# EAGLE design ESPRELAYS (EAGLE 9.4.2)
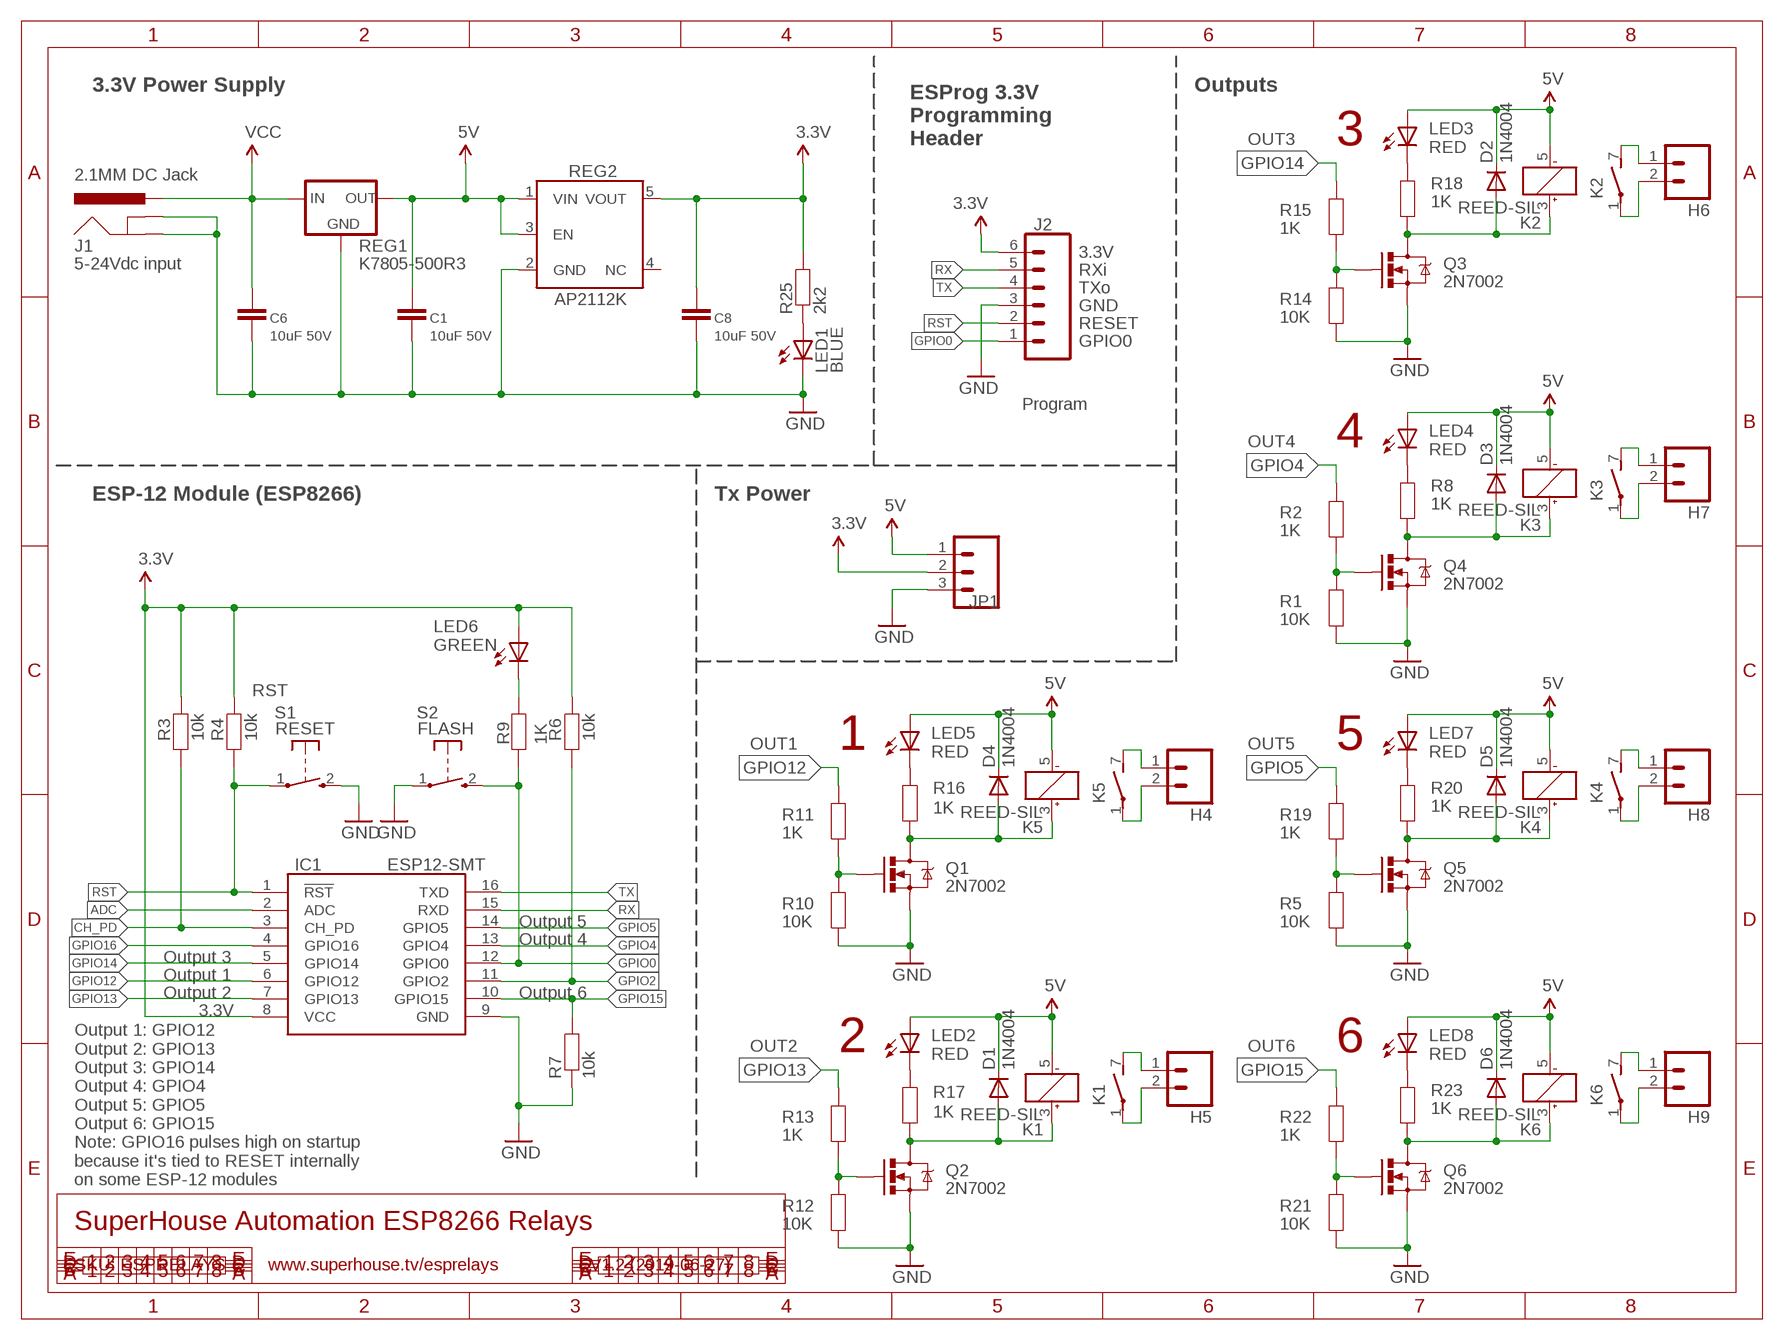
[diagram p0: schematic, sheet 1]

## Parts
C1  10uF 50V  CAP0805  [C0805]
C6  10uF 50V  CAP0805  [C0805]
C8  10uF 50V  CAP0805  [C0805]
D1  1N4004  DIODESMA  [SMA-DIODE]
D2  1N4004  DIODESMA  [SMA-DIODE]
D3  1N4004  DIODESMA  [SMA-DIODE]
D4  1N4004  DIODESMA  [SMA-DIODE]
D5  1N4004  DIODESMA  [SMA-DIODE]
D6  1N4004  DIODESMA  [SMA-DIODE]
H4  M02-PIN  [1X02-P]
H5  M02-PIN  [1X02-P]
H6  M02-PIN  [1X02-P]
H7  M02-PIN  [1X02-P]
H8  M02-PIN  [1X02-P]
H9  M02-PIN  [1X02-P]
IC1  ESP12-SMT  [ESP12]
J1  2.1MM DC Jack  POWER_JACK-SLOTS  [POWER_JACK_SLOTS]
J2  Program  M06-SOCKET  [1X06-S]
JP1  M03-PLAIN  [1X03]
K1  REED-SIL  [REED]
K2  REED-SIL  [REED]
K3  REED-SIL  [REED]
K4  REED-SIL  [REED]
K5  REED-SIL  [REED]
K6  REED-SIL  [REED]
LED1  BLUE  LED0603  [LED-0603]
LED2  RED  LED0603  [LED-0603]
LED3  RED  LED0603  [LED-0603]
LED4  RED  LED0603  [LED-0603]
LED5  RED  LED0603  [LED-0603]
LED6  GREEN  LED0603  [LED-0603]
LED7  RED  LED0603  [LED-0603]
LED8  RED  LED0603  [LED-0603]
Q1  2N7002  MOSFET-NCHANNELSMD  [SOT23-3]
Q2  2N7002  MOSFET-NCHANNELSMD  [SOT23-3]
Q3  2N7002  MOSFET-NCHANNELSMD  [SOT23-3]
Q4  2N7002  MOSFET-NCHANNELSMD  [SOT23-3]
Q5  2N7002  MOSFET-NCHANNELSMD  [SOT23-3]
Q6  2N7002  MOSFET-NCHANNELSMD  [SOT23-3]
R1  10K  RESISTOR0603  [R0603]
R2  1K  RESISTOR0603  [R0603]
R3  10k  RESISTOR0603  [R0603]
R4  10k  RESISTOR0603  [R0603]
R5  10K  RESISTOR0603  [R0603]
R6  10k  RESISTOR0603  [R0603]
R7  10k  RESISTOR0603  [R0603]
R8  1K  RESISTOR0603  [R0603]
R9  1K  RESISTOR0603  [R0603]
R10  10K  RESISTOR0603  [R0603]
R11  1K  RESISTOR0603  [R0603]
R12  10K  RESISTOR0603  [R0603]
R13  1K  RESISTOR0603  [R0603]
R14  10K  RESISTOR0603  [R0603]
R15  1K  RESISTOR0603  [R0603]
R16  1K  RESISTOR0603  [R0603]
R17  1K  RESISTOR0603  [R0603]
R18  1K  RESISTOR0603  [R0603]
R19  1K  RESISTOR0603  [R0603]
R20  1K  RESISTOR0603  [R0603]
R21  10K  RESISTOR0603  [R0603]
R22  1K  RESISTOR0603  [R0603]
R23  1K  RESISTOR0603  [R0603]
R25  2k2  RESISTOR0603  [R0603]
REG1  K7805-500R3  K78XX-500R3  [K78XX-500R3]
REG2  AP2112KSOT25  [SOT23-5]
S1  RESET  TAC_SWITCH_2PINSMT  [TACTILE_SMD_3X4X2]
S2  FLASH  TAC_SWITCH_2PINSMT  [TACTILE_SMD_3X4X2]

## Nets
3.3V: C8.1 IC1.8(VCC) J2.6 JP1.2 LED6.A R3.2 R4.2 R6.2 R25.2 REG2.5(VOUT)
5V: C1.1 D1.C D2.C D3.C D4.C D5.C D6.C JP1.1 K1.5(1:-) K2.5(1:-) K3.5(1:-) K4.5(1:-) K5.5(1:-) K6.5(1:-) LED2.A LED3.A LED4.A LED5.A LED7.A LED8.A REG1.3(OUT) REG2.1(VIN) REG2.3(EN)
ADC: IC1.2(ADC)
CH_PD: IC1.3(CH_PD) R3.1
GND: C1.2 C6.2 C8.2 IC1.9(GND) J1.GND J1.GNDBREAK J2.3 JP1.3 LED1.C Q1.2(S) Q2.2(S) Q3.2(S) Q4.2(S) Q5.2(S) Q6.2(S) R1.1 R5.1 R7.1 R10.1 R12.1 R14.1 R21.1 REG1.2(GND) REG2.2(GND) S1.2(S) S2.1(P)
GPIO0: IC1.12(GPIO0) J2.1 R9.2 S2.2(S)
GPIO2: IC1.11(GPIO2) R6.1
GPIO4: IC1.13(GPIO4) R2.2
GPIO5: IC1.14(GPIO5) R19.2
GPIO12: IC1.6(GPIO12) R11.2
GPIO13: IC1.7(GPIO13) R13.2
GPIO14: IC1.5(GPIO14) R15.2
GPIO15: IC1.10(GPIO15) R7.2 R22.2
GPIO16: IC1.4(GPIO16)
N$1: Q1.1(G) R10.2 R11.1
N$2: Q2.1(G) R12.2 R13.1
N$3: H5.1 K1.7(2:S)
N$4: LED3.C R18.1
N$5: H5.2 K1.1(2:P)
N$6: H6.1 K2.7(2:S)
N$7: Q4.1(G) R1.2 R2.1
N$8: H4.1 K5.7(2:S)
N$9: H6.2 K2.1(2:P)
N$10: Q3.1(G) R14.2 R15.1
N$11: LED4.C R8.1
N$12: H4.2 K5.1(2:P)
N$13: H7.1 K3.7(2:S)
N$14: H7.2 K3.1(2:P)
N$15: H8.1 K4.7(2:S)
N$16: H8.2 K4.1(2:P)
N$17: H9.1 K6.7(2:S)
N$18: H9.2 K6.1(2:P)
N$19: Q5.1(G) R5.2 R19.1
N$20: LED7.C R20.1
N$21: LED2.C R17.1
N$22: Q6.1(G) R21.2 R22.1
N$23: LED1.A R25.1
N$24: LED5.C R16.1
N$26: LED8.C R23.1
N$27: LED6.C R9.1
OUT1: D4.A K5.3(1:+) Q1.3(D) R16.2
OUT2: D1.A K1.3(1:+) Q2.3(D) R17.2
OUT3: D2.A K2.3(1:+) Q3.3(D) R18.2
OUT4: D3.A K3.3(1:+) Q4.3(D) R8.2
OUT5: D5.A K4.3(1:+) Q5.3(D) R20.2
OUT6: D6.A K6.3(1:+) Q6.3(D) R23.2
RST: IC1.1(!RST) J2.2 R4.1 S1.1(P)
RX: IC1.15(RXD) J2.5
TX: IC1.16(TXD) J2.4
VCC: C6.1 J1.PWR REG1.1(IN)
Unconnected: REG2.4(NC)

## Notes on the sheet
- 3.3V Power Supply | Outputs
- ESProg 3.3V
  Programming
  Header
- 3
- 3.3V
- 5-24Vdc input | RXi
- TXo
- GND
- RESET
- GPIO0
- 4
- ESP-12 Module (ESP8266) | Tx Power
- 1 | 5
- Output 5
- Output 4
- Output 3
- Output 1
- Output 2 | Output 6
- 2 | 6
- Output 1: GPIO12
  Output 2: GPIO13
  Output 3: GPIO14
  Output 4: GPIO4
  Output 5: GPIO5
  Output 6: GPIO15
  Note: GPIO16 pulses high on startup
  because it's tied to RESET internally
  on some ESP-12 modules
- SuperHouse Automation ESP8266 Relays
- SKU: ESPRELAYS | www.superhouse.tv/esprelays | V1.2 (2019-06-27)

## Library data of the parts
C1 C6 C8 = SuperHouse-DiscreteSemi:CAP: Capacitor Standard ceramic capacitor
D1-D6 = SuperHouse-DiscreteSemi:DIODE: Diode Standard reverse protection diodes and small signal diodes. SMA package can handle up to about 1A. SOD-323 can handle about 200mA.
H4-H9 = SuperHouse-Connectors:M02: Header 1x5 Standard 0.1" header.
IC1 = SuperHouse-MCUs:ESP12: ESP-12 module
J1 = SuperHouse-Connectors:POWER_JACK: Power Jack This is the standard 5.5mm barrel jack for power. The PTH is the most common, proven, reliable, footprint. All others are experimental. The Slot footprint only works if the mill layer is transmitted to the PCB fab house so be warned. Spark Fun Electronics SKU : PRT-00119. Mating wall wart : TOL-00298 (and others)
J2 = SuperHouse-Connectors:M06
JP1 = SuperHouse-Connectors:M03: Header 1x5 Standard 0.1" header.
K1-K6 = SuperHouse-Relays:REED: RELAY reed, 1 x norm. open with polarity, grid 5.08
LED1-LED8 = SuperHouse-LEDs:LED: LEDs Standard schematic elements and footprints for 5mm, 3mm, 1206, and 0603 sized LEDs. 5mm - Spark Fun Electronics SKU : COM-00529 (and others)
Q1-Q6 = SuperHouse-DiscreteSemi:MOSFET-NCHANNEL
R1-R23 R25 = SuperHouse-DiscreteSemi:RESISTOR: Resistor Standard resistors.
REG1 = SuperHouse-Regulators:K78XX-500R3: K78xx-500R3 switchmode voltage regulator
REG2 = SuperHouse-Regulators:AP2112K: AP2112K LDO linear voltage regulator
S1 S2 = SuperHouse-Switches:TAC_SWITCH_2PIN: Momentary Tactile Switch - 2 pin Uxcell 3x4x2mm switch with 2 SMT pads

## Net classes
0 default: width 0.203 mm, drill 0.356 mm, clearance 0.152 mm
1 power: width 0.203 mm, clearance 0.152 mm

## Board
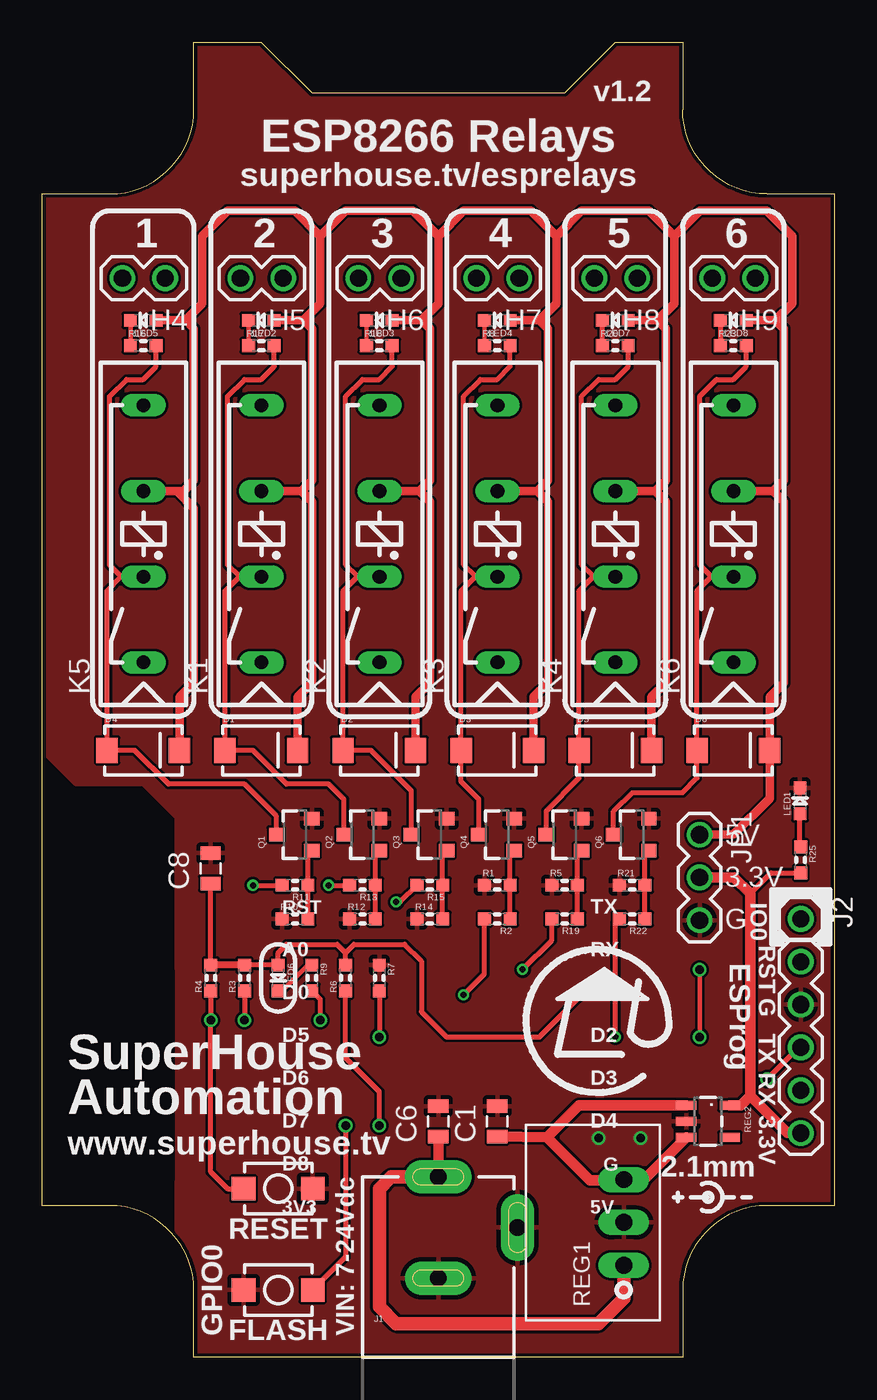
[diagram p1: board, top side]
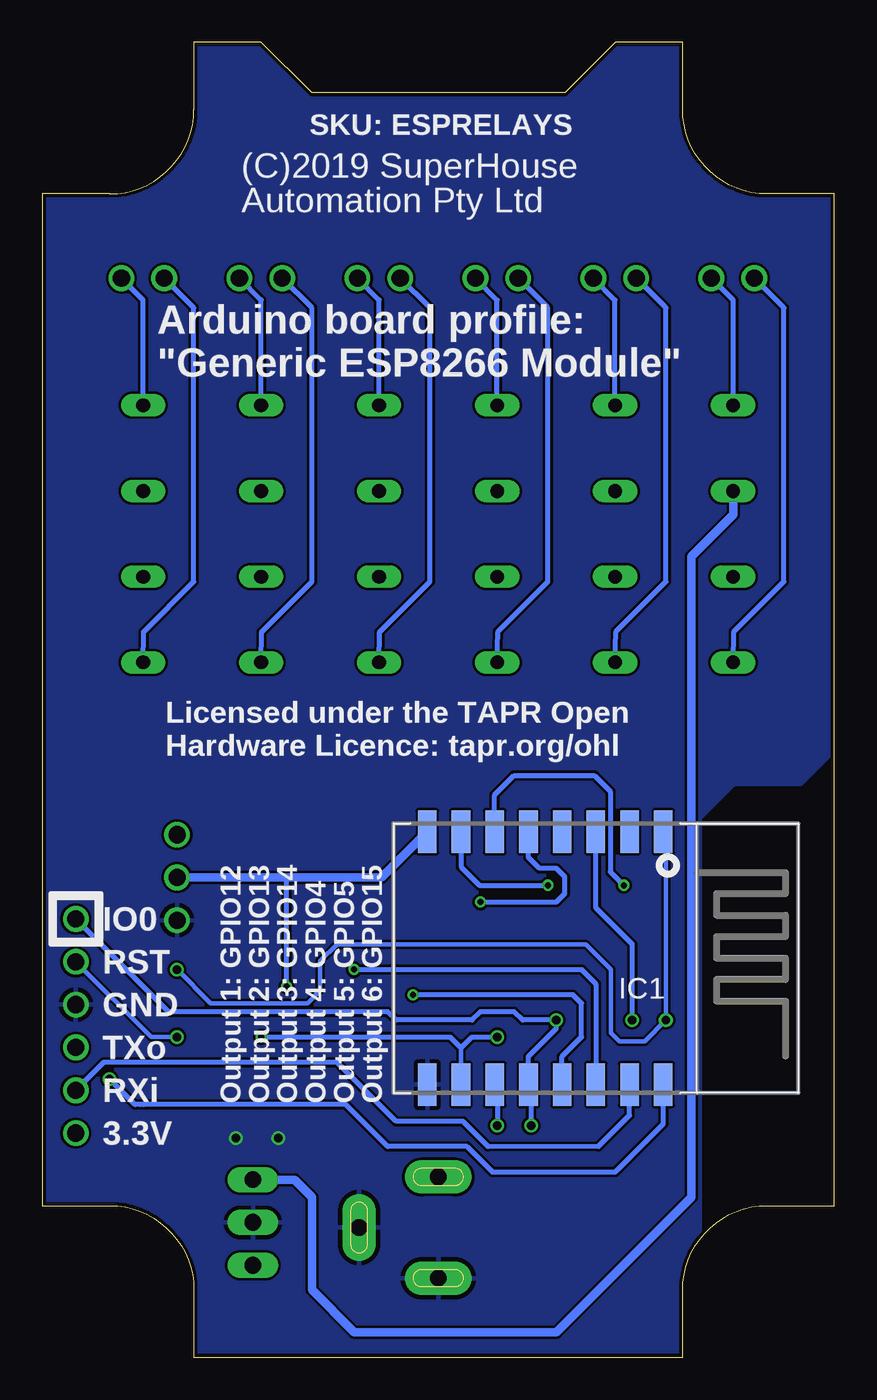
[diagram p2: board, bottom side, seen from below]

Size 47 x 78 mm. Coordinates in mm from the lower left corner, seen from the top.
Outline: 4,9 0,9 0,69 4,69 arc90 9,74 9,78 13,78 16,75 31,75 34,78 38,78 38,74 arc90 43,69 47,69 47,9 43,9 arc90 38,4 38,0 9,0 9,4 arc90 4,9
Copper layers (1*16): Top 0.035mm / dielectric 1.5mm / Bottom 0.035mm
Design rules "ElectroDragon_2layer_DRU_no_angle_20140221": minimum track width 6mil, minimum drill 12mil, track to track 6mil, track to pad 6mil, pad to pad 6mil, via to via 6mil, smd to smd 6mil, copper to edge 8mil, drill to drill 6mil, minimum pad ring 10mil, minimum via ring 6mil, stop-mask expansion 4mil, vias tented up to drill 100mil, thermal gap 10mil

### Footprints (pad centres in the part's own frame; a part is rotated, then mirrored left to right if it is on the bottom)
C0805 = smd 0.8 x 1.2: 1 -0.9,0; 2 0.9,0
SMA-DIODE = smd 1.27 x 1.47: A -2.15,0; C 2.15,0
1X02-P = drill 1.016: 1 0,0; 2 2.54,0
ESP12 = smd 1.1 x 2.5: 1 -4,-7.5; 2 -2,-7.5; 3 0,-7.5; 4 2,-7.5; 5 4,-7.5; 6 6,-7.5; 7 8,-7.5; 8 10,-7.5; 9 10,7.5; 10 8,7.5; 11 6,7.5; 12 4,7.5; 13 2,7.5; 14 0,7.5; 15 -2,7.5; 16 -4,7.5
POWER_JACK_SLOTS = drill 1 pad 2 long: GND 0,7.7; GNDBREAK 4.7,10.7; PWR 0,13.7
1X06-S = drill 1.016: 1 0,0; 2 2.54,0; 3 5.08,0; 4 7.62,0; 5 10.16,0; 6 12.7,0
1X03 = drill 1.016: 1 0,0; 2 2.54,0; 3 5.08,0
REED = drill 0.813 long: 1 -17.78,2.54; 3 -12.7,2.54; 5 -7.62,2.54; 7 -2.54,2.54
LED-0603 = smd 0.762 x 0.762: A -0.762,0; C 0.762,0
SOT23-3 = smd 0.8 x 0.9: 1 -0.95,-1; 2 0.95,-1; 3 0,1.1
R0603 = smd 0.762 x 0.762: 1 -0.762,0; 2 0.762,0
K78XX-500R3 = drill 1 long: 1 -2.54,0; 2 0,0; 3 2.54,0
SOT23-5 = smd 0.55 x 1.2: 1 -0.95,-1.3; 2 0,-1.3; 3 0.95,-1.3; 4 0.95,1.3; 5 -0.95,1.3
TACTILE_SMD_3X4X2 = smd 1.4 x 1.4: 1 -2.05,0; 2 2.05,0

### Placement (x,y rotation side)
C1  27,14 90 top
C6  23.5,14 90 top
C8  10,29 90 top
D1  13,36 0 top
D2  20,36 0 top
D3  27,36 0 top
D4  6,36 0 top
D5  34,36 0 top
D6  41,36 0 top
H4  7.3,64 180 top
H5  14.3,64 180 top
H6  21.3,64 180 top
H7  28.3,64 180 top
H8  35.3,64 180 top
H9  42.3,64 180 top
IC1  14.15,23.68 180 bottom
J1  23.5,-3 0 top
J2  45,26 270 top
JP1  39,31 270 top
K1  15.55,59 90 top
K2  22.55,59 90 top
K3  29.55,59 90 top
K4  36.55,59 90 top
K5  8.55,59 90 top
K6  43.55,59 90 top
LED1  44.96,33 90 top
LED2  13,61.5 180 top
LED3  20,61.5 180 top
LED4  27,61.5 180 top
LED5  6,61.5 180 top
LED6  14,22.5 270 top
LED7  34,61.5 180 top
LED8  41,61.5 180 top
Q1  15,31 90 top
Q2  19,31 90 top
Q3  23,31 90 top
Q4  27,31 90 top
Q5  31,31 90 top
Q6  35,31 90 top
R1  27,28 0 top
R2  27,26 180 top
R3  12,22.5 90 top
R4  10,22.5 90 top
R5  31,28 0 top
R6  18,22.5 90 top
R7  20,22.5 270 top
R8  27,60 0 top
R9  16,22.5 270 top
R10  15,26 0 top
R11  15,28 180 top
R12  19,26 0 top
R13  19,28 180 top
R14  23,26 0 top
R15  23,28 180 top
R16  6,60 0 top
R17  13,60 0 top
R18  20,60 0 top
R19  31,26 180 top
R20  34,60 0 top
R21  35,28 0 top
R22  35,26 180 top
R23  41,60 0 top
R25  45,29.5 270 top
REG1  34.5,8 90 top
REG2  39.5,14 270 top
S1  14,10 0 top
S2  14,4 0 top

### Tracks (layer width: path | path; a pad name or v marks a point on that pad's centre or on a via)
3.3V  (via drill 0.36)
  Top 0.305: R3.2 LED6.A 14,24 14.5,24.5 17.5,24.5 18,24 | R6.2 18,24 | R4.2 C8.1 | 18,24 18.5,24.5 21.5,24.5 22.5,23.5 22.5,20.5 24,19 29.5,19 v32.5,22 | 42,27.5 43.24,28.74 R25.2
  Top 0.406: R3.2 R4.2
  Top 0.61: 42,15.5 41.45,14.95 REG2.5 | JP1.2 41.04,28.46 42,27.5 42,15.5 | J2.6 44.2,13.3 42,15.5
  Bottom 0.305: v32.5,22 32.5,28.46
  Bottom 0.508: IC1.8 26.87,28.46 32.5,28.46 JP1.2
5V
  Top 0.508: 8.5,61.5 9,61 9,52 8.38,51.38 8,51.38 | 8.5,61.5 LED5.A | 8.5,61.5 9.5,62.5 9.5,66.5 11,68 15,68 16.5,66.5 | 16.5,66.5 16.5,62.5 15.5,61.5 | 15.5,61.5 LED2.A | 15.5,61.5 16,61 16,52 15.38,51.38 | 22.5,61.5 23,61 23,52 22.38,51.38 | 22.5,61.5 LED3.A | 16.5,66.5 18,68 22,68 23.5,66.5 | 23.5,66.5 23.5,62.5 22.5,61.5 | 29.5,61.5 30,61 30,52 29.38,51.38 | 29.5,61.5 LED4.A | 23.5,66.5 25,68 29,68 30.5,66.5 | 30.5,66.5 30.5,62.5 29.5,61.5 | 36.5,61.5 37,61 37,52 36.38,51.38 | 36.5,61.5 LED7.A | 30.5,66.5 32,68 36,68 37.5,66.5 | 36.5,61.5 37.5,62.5 37.5,66.5 | 37.5,66.5 39,68 43,68 44.5,66.5 44.5,62.5 43.5,61.5 | 8,51.38 K5.5 | 15.38,51.38 K1.5 | 22.38,51.38 K2.5 | 29.38,51.38 K3.5 | 36.38,51.38 K4.5 | 43.38,51.38 44,52 44,61 43.5,61.5 | 43.38,51.38 K6.5 | 43.5,61.5 LED8.A | 15.38,51.38 16,50.76 16,40 15.15,39.15 D1.C | 8,51.38 9,50.38 9,40 8.15,39.15 D4.C | 22.38,51.38 23,50.76 23,40 22.15,39.15 D2.C | 29.38,51.38 30,50.76 30,40 29.15,39.15 D3.C | 36.38,51.38 37,50.76 37,40 36.15,39.15 D5.C | 43.38,51.38 44,50.76 44,40 43.15,39.15 D6.C 43.15,33.15 41,31 JP1.1
  Top 0.61: REG2.3 35.69,10.54 REG1.3 34.46,10.5 32.5,10.5 29.95,13.05 | 29.95,13.05 C1.1 | REG2.1 31.85,14.95 29.95,13.05
  Bottom 0.508: REG1.3 32.04,10.54 31,9.5 31,4 28.5,1.5 16.5,1.5 8.5,9.5 8.5,47.5 6.01,49.99 K5.5
CH_PD  (via drill 0.5)
  Top 0.305: R3.1 v12,20
  Bottom 0.305: v12,20 12,24.5 14.15,26.65 IC1.3
GND  (via drill 0.5)
  other vias: 35.5,13 33,13
  pour Top: 7.98,7 arc-40 8.98,4 8.98,0 38,0 38,4 arc-90 43,9 47,9 47,78 0,78 0,36 2,34 6,34 7.99,32.01 7.99,32 7.98,32 8,14
  pour Bottom: 47,78 0,78 0,36 2,34 5.98,34 7.98,32 8,14 7.98,7 arc-40 8.98,4 8.98,0 38,0 38,4 arc-90 43,9 47,9
GPIO0  (via drill 0.5)
  Top 0.305: R9.2 16.5,21.24 v16.5,20 | S2.2 18,5.95 v18,13.75
  Bottom 0.254: IC1.12 18,16.02
  Bottom 0.305: 18,16.02 v18,13.75 | IC1.12 18.15,17.85 16.5,19.5 v16.5,20 18.5,20 19,20.5 21,20.5 21.5,20 26,20 26.5,20.5 39.5,20.5 J2.1
GPIO2  (via drill 0.5)
  Top 0.305: R6.1 18,17.75 20,15.75 v20,13.75
  Bottom 0.254: IC1.11 20,16.02
  Bottom 0.305: 20,16.02 v20,13.75
GPIO4  (via drill 0.36)
  Top 0.305: v25,21.5 26.24,22.74 R2.2
  Bottom 0.305: IC1.13 16.15,17.85 15,19 15,21 15.5,21.5 v25,21.5
GPIO5  (via drill 0.36)
  Top 0.305: v28.5,23 30.24,24.74 R19.2
  Bottom 0.305: IC1.14 14.15,22.15 15,23 v28.5,23
GPIO12  (via drill 0.36)
  Top 0.305: v12.5,28 R11.2
  Bottom 0.305: IC1.6 20.15,33.35 19,34.5 14.24,34.5 13.3,33.55 13.3,28.8 v12.5,28
GPIO13  (via drill 0.36)
  Top 0.305: v17,28 R13.2
  Bottom 0.305: IC1.7 22.15,29.1 21.06,28 v17,28
GPIO14  (via drill 0.36)
  Top 0.305: R15.2 21.24,27 v21,27
  Bottom 0.305: v21,27 16.5,27 16,27.5 16,28.5 16.5,29 17.5,29 18.15,29.65 IC1.5
GPIO15  (via drill 0.36, 0.5)
  Top 0.305: R7.2 v20,19 | v34,19 34,25.76 R22.2
  Bottom 0.254: 22.15,18.35 IC1.10
  Bottom 0.305: v20,19 21.5,19 22.15,18.35 22.81,19 v34,19
N$1
  Top 0.254: 15.76,29.81 Q1.1
  Top 0.305: R10.2 R11.1 15.76,29.81
N$2
  Top 0.254: 19.76,29.81 Q2.1
  Top 0.305: R12.2 R13.1 19.76,29.81
N$3
  Bottom 0.305: K1.7 13.01,62.71 H5.1
N$4
  Top 0.254: R18.1 LED3.C
N$5
  Bottom 0.305: K1.1 12.96,43.04 10,46 10,62.24 H5.2
N$6
  Bottom 0.305: K2.7 20.01,62.71 H6.1
N$7
  Top 0.305: R2.1 R1.2 27.76,29.81 Q4.1
N$8
  Bottom 0.305: K5.7 6.01,62.71 H4.1
N$9
  Bottom 0.305: K2.1 19.96,43.04 17,46 17,62.24 H6.2
N$10
  Top 0.254: 23.76,29.81 Q3.1
  Top 0.305: R14.2 R15.1 23.76,29.81
N$11
  Top 0.254: R8.1 LED4.C
N$12
  Bottom 0.305: K5.1 5.96,43.04 3,46 3,62.24 H4.2
N$13
  Bottom 0.305: K3.7 27.01,62.71 H7.1
N$14
  Bottom 0.305: K3.1 26.98,43.02 24,46 24,62.24 H7.2
N$15
  Bottom 0.305: K4.7 34.01,62.71 H8.1
N$16
  Bottom 0.305: K4.1 33.98,43.02 31,46 31,62.24 H8.2
N$17
  Bottom 0.305: K6.7 41.01,62.71 H9.1
N$18
  Bottom 0.305: K6.1 40.98,43.02 38,46 38,62.24 H9.2
N$19
  Top 0.305: R19.1 R5.2 31.76,29.81 Q5.1
N$20
  Top 0.305: R20.1 LED7.C
N$21
  Top 0.254: R17.1 LED2.C
N$22
  Top 0.305: R22.1 R21.2 35.76,29.81 Q6.1
N$23
  Top 0.305: R25.1 44.96,30.3 LED1.A
N$24
  Top 0.254: R16.1 LED5.C
N$26
  Top 0.305: LED8.C R23.1
N$27
  Top 0.254: LED6.C 14.24,21.74 15.76,23.26 R9.1
OUT1
  Top 0.305: K5.3 4.7,46.3 | 4.7,46.3 4,47 4,57 5,58 6,58 6.76,58.76 R16.2 | 4.7,46.3 3.85,45.45 D4.A 5.5,36 7.5,34 12,34 13.9,32.1 Q1.3
OUT2
  Top 0.305: K1.3 11.7,46.3 | 11.7,46.3 11,47 11,57 12,58 13,58 13.76,58.76 R17.2 | 11.7,46.3 10.85,45.45 D1.A 12.5,36 14.5,34 17,34 17.9,33.1 Q2.3
OUT3
  Top 0.305: K2.3 18.7,46.3 | 18.7,46.3 18,47 18,57 19,58 20,58 20.76,58.76 R18.2 | 18.7,46.3 17.85,45.45 D2.A 19.5,36 21.9,33.6 Q3.3
OUT4
  Top 0.305: K3.3 25.7,46.3 | 25.7,46.3 25,47 25,57 26,58 27,58 27.76,58.76 R8.2 | 25.7,46.3 24.85,45.45 D3.A 24.85,34.15 25.9,33.1 Q4.3
OUT5
  Top 0.305: K4.3 32.7,46.3 | 32.7,46.3 32,47 32,57 33,58 34,58 34.76,58.76 R20.2 | 32.7,46.3 31.85,45.45 D5.A 31.85,34.35 29.9,32.4 Q5.3
OUT6
  Top 0.305: K6.3 39.7,46.3 | 39.7,46.3 39,47 39,57 40,58 41,58 41.76,58.76 R23.2 | 39.7,46.3 38.85,45.45 D6.A 38.85,34.35 38,33.5 35,33.5 33.9,32.4 Q6.3
RST  (via drill 0.5)
  Top 0.254: v39,23 v39,19
  Top 0.305: R4.1 v10,20 10,11 11,10 S1.1
  Bottom 0.254: v39,23 37,21 31.25,21 30.5,21.75 30.5,23.5 29.5,24.5 14.75,24.5 13.25,23 13.25,19.25 12.75,18.75 11.25,18.75 v10,20 10,31.02 IC1.1 | v39,19 40.54,19 J2.2
RX
  Bottom 0.254: 20.55,12.5 14,12.5
  Bottom 0.305: 20.55,12.5 22.05,14 26,14 29.5,17.5 43.34,17.5 J2.5 | IC1.15 12.15,14.35 14,12.5
TX  (via drill 0.5)
  Top 0.305: v43,16.5 44.88,18.38 J2.4
  Bottom 0.305: IC1.16 10.15,13.85 13,11 20.3,11 21.8,12.5 26.5,12.5 29,15 41,15 41.16,15 41.5,15 v43,16.5
VCC
  Top 0.61: C6.1 J1.PWR
  Top 0.813: J1.PWR 20.7,10.7 20,10 20,3 21,2 33,2 34.5,3.5 REG1.1

### Text on the board
tPlace: v1.2 | ESP8266 Relays | superhouse.tv/esprelays | 1 | 2 | 3 | 4 | 5 | 6 | 5V | 3.3V | G | IO0 | RST | G | ESProg | TX | RX | SuperHouse / Automation | 3.3V | www.superhouse.tv | 2.1mm | RESET | VIN: 7-24Vdc | GPIO0 | FLASH
bPlace: SKU: ESPRELAYS | (C)2019 SuperHouse / Automation Pty Ltd | Arduino board profile: / "Generic ESP8266 Module" | Licensed under the TAPR Open / Hardware Licence: tapr.org/ohl | IO0 | RST | GND | TXo | RXi | Output 1: GPIO12 / Output 2: GPIO13 / Output 3: GPIO14 / Output 4: GPIO4 / Output 5: GPIO5 / Output 6: GPIO15 | 3.3V
tNames: RST | TX | A0 | RX | D0 | D1 | D5 | D2 | D6 | D3 | D7 | D4 | D8 | G | 3V3 | 5V